# Altium schematic sheet gclk_usb.SchDoc
size A
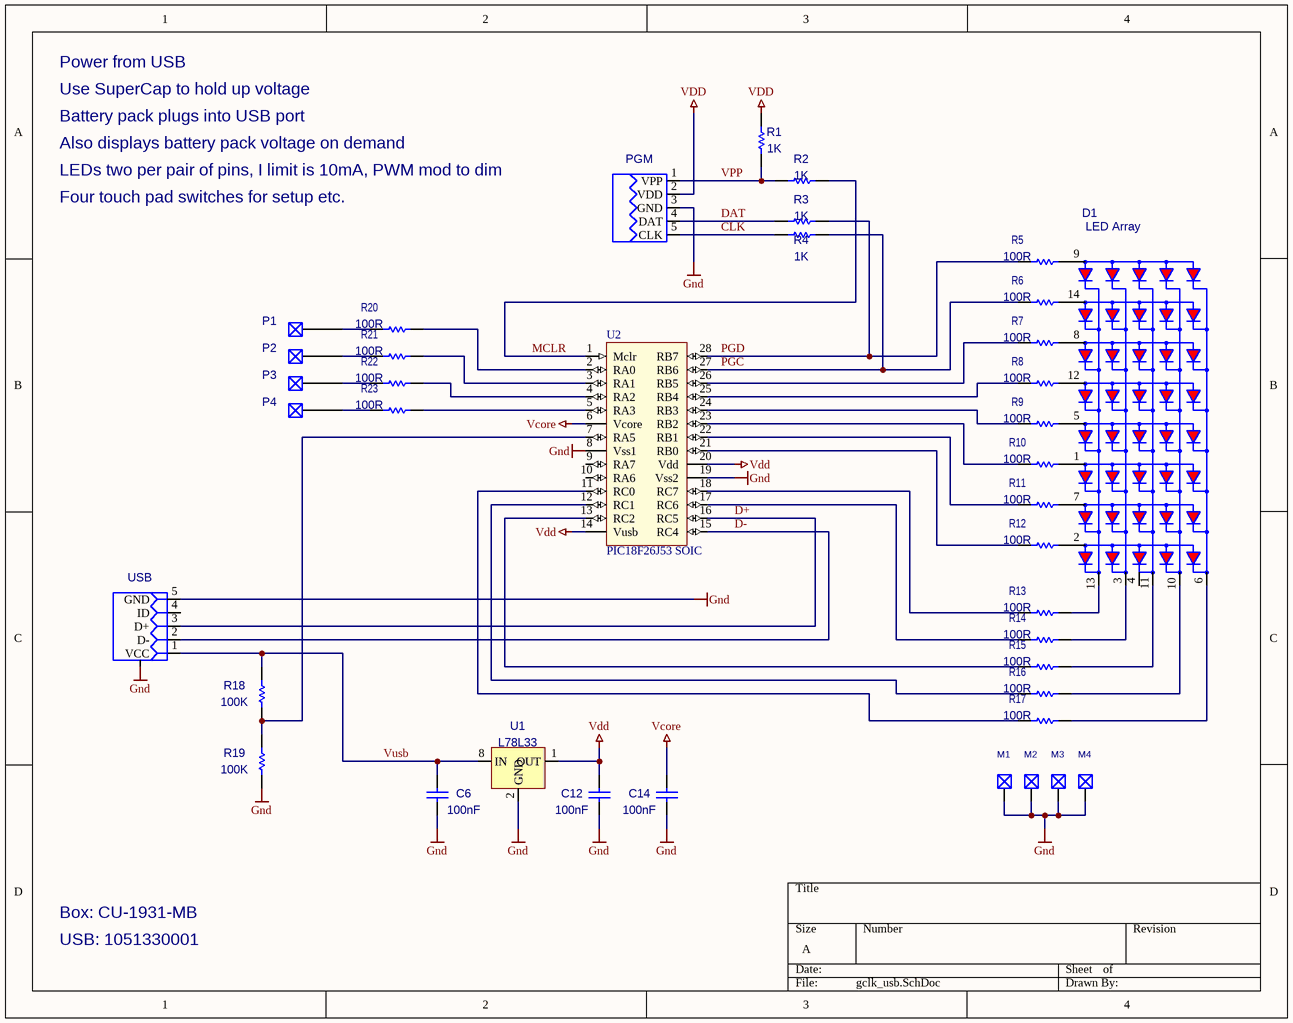
[diagram p0: gclk_usb.SchDoc]

## Parts
C6  value 100nF  [CAPC0805(2012)145_M]  (hidden comment: CAP 100nF 50V 0805(2012))
C12  value 100nF  [CAPC0805(2012)145_M]  (hidden comment: CAP 100nF 50V 0805(2012))
C14  value 100nF  [CAPC0805(2012)145_N]  (hidden comment: CAP 100nF 50V 0805(2012))
D1  LED Array  [LTP-2158]
M1  HOLE128.3-128.3-NP  [HOLE128.3-128.3-NP]  (value not drawn)
M2  HOLE128.3-128.3-NP  [HOLE128.3-128.3-NP]  (value not drawn)
M3  HOLE128.3-128.3-NP  [HOLE128.3-128.3-NP]  (value not drawn)
M4  HOLE128.3-128.3-NP  [HOLE128.3-128.3-NP]  (value not drawn)
P1  PAD143-190-12GA  [PAD143-190-12GA]  (value not drawn)
P2  PAD143-190-12GA  [PAD143-190-12GA]  (value not drawn)
P3  PAD143-190-12GA  [PAD143-190-12GA]  (value not drawn)
P4  PAD143-190-12GA  [PAD143-190-12GA]  (value not drawn)
PGM  Program Header  [ProgHeader_100]  (value not drawn)
R1  1K  [RESC0603(1608)_M]
R2  1K  [RESC0603(1608)_M]
R3  1K  [RESC0603(1608)_M]
R4  1K  [RESC0603(1608)_M]
R5  100R  [RESC0603(1608)_M]
R6  100R  [RESC0603(1608)_M]
R7  100R  [RESC0603(1608)_M]
R8  100R  [RESC0603(1608)_M]
R9  100R  [RESC0603(1608)_M]
R10  100R  [RESC0603(1608)_M]
R11  100R  [RESC0603(1608)_M]
R12  100R  [RESC0603(1608)_M]
R13  100R  [RESC0603(1608)_M]
R14  100R  [RESC0603(1608)_M]
R15  100R  [RESC0603(1608)_M]
R16  100R  [RESC0603(1608)_M]
R17  100R  [RESC0603(1608)_M]
R18  100K  [RESC0603(1608)_N]
R19  100K  [RESC0603(1608)_N]
R20  100R  [RESC0603(1608)_M]
R21  100R  [RESC0603(1608)_M]
R22  100R  [RESC0603(1608)_M]
R23  100R  [RESC0603(1608)_M]
U1  L78L33  [NCV78L00A]
U2  PIC18F26J53 SOIC  [Microchip SOIC 28 Wide]
USB  USB  [105133-0001]  (value not drawn)

## Nets
Gnd: C6.1 C12.1 C14.1 M1.1 M2.1 M3.1 M4.1 PGM.3(GND) R19.2 U1.2(GND) U2.8(Vss1) U2.19(Vss2) USB.0 USB.5(GND)
Vcore: C14.2 U2.6(Vcore)
VDD: C12.2 PGM.2(VDD) R1.2 U1.1(OUT) U2.14(Vusb) U2.20(Vdd)
CLK: PGM.5(CLK) R4.2
D+: U2.16(RC5) USB.3(D+)
D-: U2.15(RC4) USB.2(D-)
DAT: PGM.4(DAT) R3.2
MCLR: R2.1 U2.1(Mclr)
PGC: R4.1 R6.1 U2.27(RB6)
PGD: R3.1 R5.1 U2.28(RB7)
VPP: PGM.1(VPP) R1.1 R2.2
Vusb: C6.2 R18.1 U1.8(IN) USB.1(VCC)
NetD1_1: D1.1 R10.2
NetD1_2: D1.2 R12.2
NetD1_3: D1.3 R14.2
NetD1_5: D1.5 R9.2
NetD1_6: D1.6 R17.2
NetD1_7: D1.7 R11.2
NetD1_8: D1.8 R7.2
NetD1_9: D1.9 R5.2
NetD1_10: D1.10 R16.2
NetD1_11: D1.11 R15.2
NetD1_12: D1.12 R8.2
NetD1_13: D1.13 R13.2
NetD1_14: D1.14 R6.2
NetP1_1: P1.1 R20.1
NetP2_1: P2.1 R21.1
NetP3_1: P3.1 R22.1
NetP4_1: P4.1 R23.1
NetR7_1: R7.1 U2.26(RB5)
NetR8_1: R8.1 U2.25(RB4)
NetR9_1: R9.1 U2.24(RB3)
NetR10_1: R10.1 U2.23(RB2)
NetR11_1: R11.1 U2.22(RB1)
NetR12_1: R12.1 U2.21(RB0)
NetR13_1: R13.1 U2.18(RC7)
NetR14_1: R14.1 U2.17(RC6)
NetR15_1: R15.1 U2.13(RC2)
NetR16_1: R16.1 U2.12(RC1)
NetR17_1: R17.1 U2.11(RC0)
NetR18_2: R18.2 R19.1 U2.7(RA5)
NetR20_2: R20.2 U2.2(RA0)
NetR21_2: R21.2 U2.3(RA1)
NetR22_2: R22.2 U2.4(RA2)
NetR23_2: R23.2 U2.5(RA3)

Not connected (* = marked no-connect by the designer): D1 4; U2 9(RA7) 10(RA6); USB 4(ID)

## Notes on the sheet
- Power from USB
- Use SuperCap to hold up voltage
- Battery pack plugs into USB port
- Also displays battery pack voltage on demand
- LEDs two per pair of pins, I limit is 10mA, PWM mod to dim
- Four touch pad switches for setup etc.
- Box: CU-1931-MB
- USB: 1051330001

## Library data of the parts
C6 C12 C14 = CMP-1036-04422-1: CAP 100nF 50V ±20% 0805 (2012 Metric) Thickness 1.45mm SMD; Case-Metric: 2012; Case-EIA: 0805; AS P/N: ASC_100n_0805; Tolerance: ±20%; Max Thickness: 1.45 mm; Technology: SMT; Rated Voltage: 50 V
D1 = LTP-2158: LED Matrix 5x8 2.3" Hi Effeciency Red; ModifyDate: 11/19/2010 06:25:10
PGM = ProgHeader_100: Programming header, 0.100" centres
R1-R4 = CMP-1012-00510-1: 1K 0.1W 1% 0603 (1608 Metric)  SMD; Case-Metric: 1608; Case-EIA: 0603; Value: 1000.00 Ohm; Technology: SMT; Tolerance: 1 %; Power: 0.1 W
R5-R17 R20-R23 = CMP-1012-00397-1: 100R 0.1W 1% 0603 (1608 Metric)  SMD; Value: 100.00 Ohm; Case-EIA: 0603; Case-Metric: 1608; Technology: SMT; Tolerance: 1 %; Power: 0.1 W
R18 R19 = CMP-1012-00736-1: 100K 0.1W 1% 0603 (1608 Metric)  SMD; Value: 100000.00 Ohm; Case-Metric: 1608; Case-EIA: 0603; Power: 0.1 W; Tolerance: 1 %; Technology: SMT
U1 = NCV78L05A: 5V, 100mA Positive Voltage Regulator; AS P/N: 78L05
U2 = PIC18F26J53 SOIC: AS P/N: PIC18F26J53_SOIC
USB = 105133-0001: Micro USB B Receptacle Vertical Type; AS P/N: 105133-0001
M1-M4 = HOLE128.3-128.3-NP: ModifyDate: 11/19/2010 06:25:10; Value: *
P1-P4 = PAD143-190-12GA: ModifyDate: 11/19/2010 06:25:12; Value: *